# Altium schematic sheet DCDC-LMR16030.SchDoc
size A3; Revision: 8
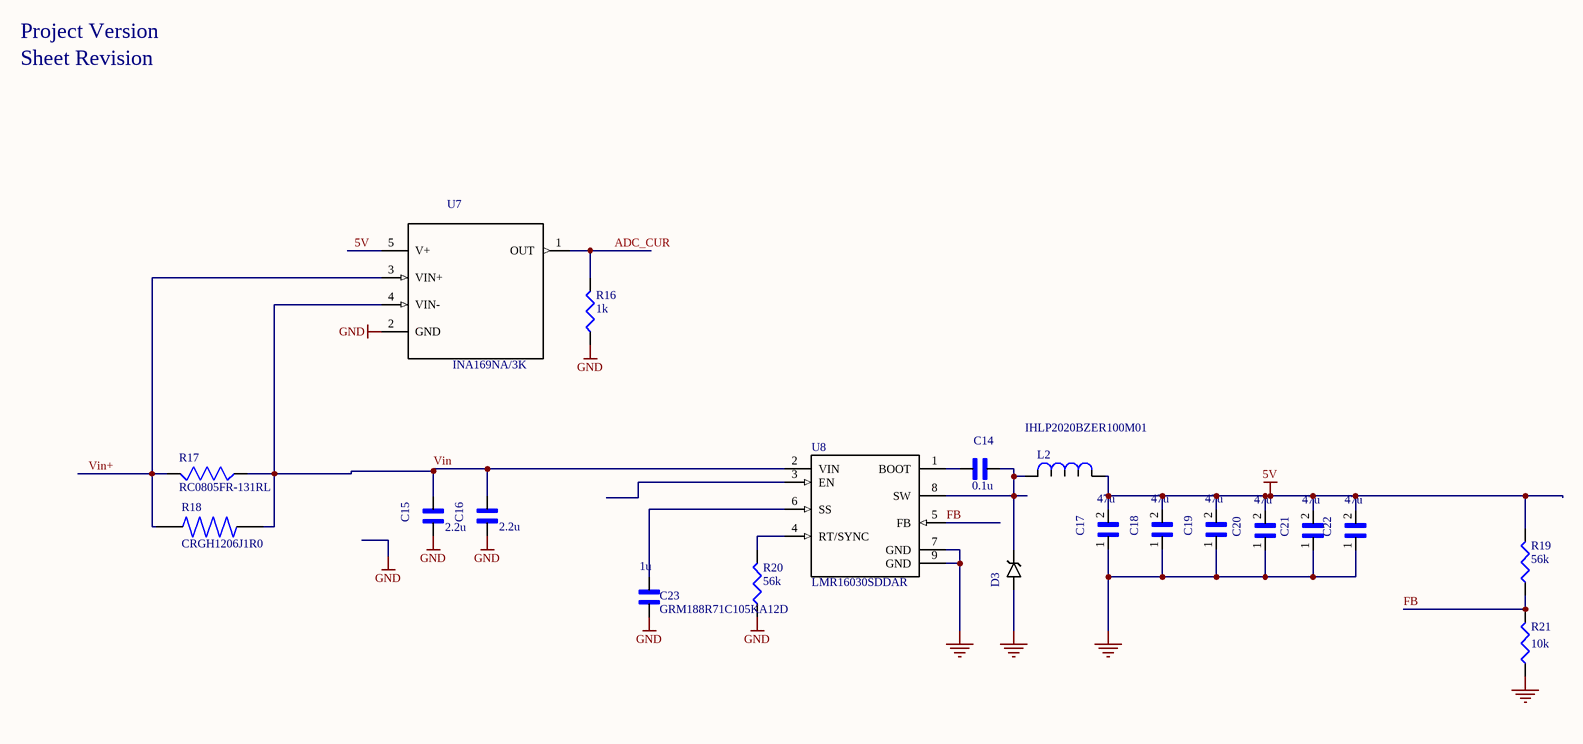
[diagram p0: DCDC-LMR16030.SchDoc]

## Parts
C14  value 0.1u  [*CAPC1608X90]  (hidden comment: GX035C104MAT2-500)
C15  value 2.2u  [*CAP3216X125N]  (hidden comment: GRM31CR71H225KA88L)
C16  value 2.2u  [*CAP3216X125N]  (hidden comment: GRM31CR71H225KA88L)
C17  value 47u  [*CAPC3216X125N]  (hidden comment: GRM31CR61A476KE15L)
C18  value 47u  [*CAPC3216X125N]  (hidden comment: GRM31CR61A476KE15L)
C19  value 47u  [*CAPC3216X125N]  (hidden comment: GRM31CR61A476KE15L)
C20  value 47u  [*CAPC3216X125N]  (hidden comment: GRM31CR61A476KE15L)
C21  value 47u  [*CAPC3216X125N]  (hidden comment: GRM31CR61A476KE15L)
C22  value 47u  [*CAPC3216X125N]  (hidden comment: GRM31CR61A476KE15L)
C23  GRM188R71C105KA12D  value 1u  [CAPC1608X90N]
D3  SK56  [*SMB_P6SMB62AT3G(Primary)]  (value not drawn)
L2  IHLP2020BZER100M01  [IHLP]
R16  value 1k  [J1-0603]  (hidden comment: Res3)
R17  RC0805FR-131RL  [RESC2012X60]
R18  CRGH1206J1R0  [RESC3115X65N]
R19  value 56k  [J1-0603]  (hidden comment: Res3)
R20  value 56k  [J1-0603]  (hidden comment: Res3)
R21  value 10k  [J1-0603]  (hidden comment: RC0603FR-0710KL)
U7  INA169NA/3K  [*SOT95P280X145-5N]
U8  LMR16030SDDAR  [*SOIC127P600X170-9N - duplicate]

## Nets
5V: C17.2 C18.2 C19.2 C20.2 C21.2 C22.2 L2.1 R19.2 U7.5(V+)
GND: C15.2 C16.2 C17.1 C18.1 C19.1 C20.1 C21.1 C22.1 C23.1 D3.A R16.1 R20.1 R21.1 U7.2(GND) U8.7(GND) U8.9(GND)
ADC_CUR: R16.2 U7.1(OUT)
FB: R19.1 R21.2 U8.5(FB)
Vin: C15.1 C16.1 R17.2 R18.2 U7.4(VIN-) U8.2(VIN)
Vin+: R17.1 R18.1 U7.3(VIN+)
NetC14_1: C14.1 D3.C L2.2 U8.8(SW)
NetC14_2: C14.2 U8.1(BOOT)
NetC23_2: C23.2 U8.6(SS)
NetR20_2: R20.2 U8.4(RT/SYNC)

Not connected (* = marked no-connect by the designer): U8 3(EN)

## Notes on the sheet
- Project Version
- Sheet Revision

## Library data of the parts
C14 = GX035C104MAT2-500: Cap Thin Film 0.1uf 50v 0603; MF: AVX; MP: GX035C104MAT2-500 or CL10B104JB8NNNC; Pacage Metric: 1608; Type: SMD; Package: 0603 AVX; SnapEDA_Link: https://www.snapeda.com/parts/GX035C104MAT2-500/AVX/view-part/?ref=snap
C15 C16 = GRM31CR71H225KA88L: / 1206 2.2 uF 50 V В±10% Tolerance X7R SMT Multilayer Ceramic Capacitor /; MF: Murata Electronics; Type: SMD; Package: 1206 Murata; SnapEDA_Link: https://www.snapeda.com/parts/GRM31CR71H225KA88L/Murata%20Electronics%20North%20America/view-part/?ref=snap; MP: GRM31CR71H225KA88L
C17-C22 = GRM31CR61A476KE15L: Multilayer Ceramic Capacitor, GRM Series, 47 - F, - 10%, X5R, 10 V, 1206 [3216 Metric]; MF: Murata Electronics; Type: SMD; Package: 1206 Murata Electronics; MP: GRM31CR61A476KE15L; SnapEDA_Link: https://www.snapeda.com/parts/GRM31CR61A476KE15L/Murata%20Electronics%20North%20America/view-part/?ref=snap
C23 = GRM188R71C105KA12D: SMD Capacitor X7R(EIA) with Capacitance: 1.0uF Tol. 10%. Rated Voltage: 16Vdc; MF: Murata Electronics; Pacage Metric: 1608; MP: GRM188R71C105KA12D; SnapEDA_Link: https://www.snapeda.com/parts/GRM188R71C105KA12D/Murata%20Electronics%20North%20America/view-part/228340/?ref=snap; Package: 0603; ChipDip_Link: https://www.chipdip.ru/product/grm188r71c105ka12d; HelpURL: https://static.chipdip.ru/lib/428/DOC005428493.pdf; Type: SMD
D3 = SK56: Диод Шоттки 5А 60В [SMB / DO-214AA]; MF: Littelfuse Inc.; Type: SMD; MP: SK56; Package: DO-214 Littelfuse; SnapEDA_Link: https://www.snapeda.com/parts/P6SMB62AT3G/Littelfuse%20Inc./view-part/?ref=snap; Value: *; ChipDip_Link: https://www.chipdip.ru/product/sk56
L2 = IHLP2020BZER100M01: 10ÂµH Shielded Molded Inductor 2.3A 199mOhm Max Nonstandard; MF: Vishay Dale; Type: SMD; SnapEDA_Link: https://www.snapeda.com/parts/IHLP2020BZER100M01/Vishay%20Dale/view-part/44808/?ref=snap; MP: IHLP2020BZER100M01; Value: *; Package: Nonstandard Vishay; HelpURL: http://www.vishay.com/docs/34253/ihlp-2020bz-01.pdf; ChipDip_Link: https://www.chipdip.ru/product/ihlp2020bzer100m11-inductor-ihlp-smd-2020-10
R16 = Res3: Resistor; Published: 8-Jun-2000; LatestRevisionDate: 29-May-2009; LatestRevisionNote: IPC-7351 Footprint Added.; PackageReference: J1-0603; Publisher: Altium Limited; PackageDescription: Chip Resistor
R17 = RC0805FR-131RL: RC Series 0805 0.125 W 2 kOhms 5% В±100 ppm/В°C SMT Thick Film Chip Resistor; MF: {'manufacturer': u'Yageo'}; Availability: Unavailable; MP: RC0805FR-131RL; Value: *; Price: None; Package: None
R18 = CRGH1206J1R0: Res Thick Film 1206 1 Ohm 5% 1/2W В±200ppm/В°C Molded SMD SMD T/R; MF: {'manufacturer': u'TE Connectivity'}; Availability: Unavailable; Price: None; Package: None; Value: *; MP: CRGH1206J1R0
R19 R20 = Res3: Resistor; Pacage Metric: 1608; MP: RC0603FR-0756KL; ChipDip_Link: https://www.chipdip.ru/product0/9000079754; HelpURL: https://www.chipdip.ru/product0/9000079754; Package: R0603; Type: SMD
R21 = RC0603FR-0710KL: 10 kOhms 1 0.1 W 1 10 W Chip Resistor 0603 1608 Metric Thick Film; Pacage Metric: 1608; MF: Yageo or NXP; MP: 10K 1% 0603; ChipDip_Link: https://www.chipdip.ru/product0/9000079736; HelpURL: https://www.chipdip.ru/product0/9000079736; Package: R0603; Type: SMD; SnapEDA_Link: https://www.snapeda.com/parts/RC0603FR-0710KL/Yageo/view-part/?ref=dk&t=RC0603FR-0710KL&con_ref=None
U7 = INA169NA/3K: Current Monitor Regulator High-Side SOT-23-5; MF: Texas Instruments; Package: SOT-23-5 Texas Instruments; Availability: Unavailable; SnapEDA_Link: https://www.snapeda.com/parts/INA169NA/3K/Texas%20Instruments/view-part/449193/?ref=snap; MP: INA169NA/3K; Price: None; Value: *
U8 = LMR16030SDDAR: LMR16030SDDAR, Conv DC-DC 4.3V to 60V Step Down Single-Out 1V to 50V 3A Automotive 8-Pin HSOP EP T/R; MF: Texas Instruments; SnapEDA_Link: https://www.snapeda.com/parts/TPS54560DDA/Texas%20Instruments/view-part/?ref=snap; MP: LMR16030SDDAR; Package: PowerSOIC-8 Texas Instruments; Value: *; Type: SMD; ChipDip_Link: https://www.chipdip.ru/product1/8003448566; HelpURL: https://www.ti.com/lit/ds/symlink/lmr16030.pdf